# Altium schematic sheet 单片机系统电路.SchDoc
size A4; Time: 22/03/31
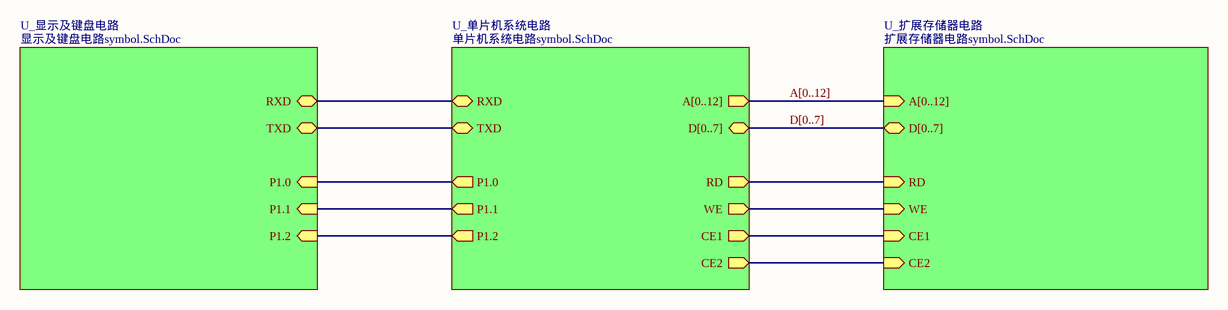
[diagram p0: 单片机系统电路.SchDoc]

## Sub-sheets
U_单片机系统电路 = 单片机系统电路symbol.SchDoc: RXD (bidir), TXD (bidir), P1.0 (out), P1.1 (out), P1.2 (out), A[0..12] (out), D[0..7] (bidir), RD (out), WE (out), CE1 (out), CE2 (out)
U_扩展存储器电路 = 扩展存储器电路symbol.SchDoc: A[0..12] (in), D[0..7] (bidir), RD (in), WE (in), CE1 (in), CE2 (in)
U_显示及键盘电路 = 显示及键盘电路symbol.SchDoc: RXD (bidir), TXD (bidir), P1.0 (in), P1.1 (in), P1.2 (in)

## Nets
(unnamed): sheet U_单片机系统电路/RXD, sheet U_显示及键盘电路/RXD
(unnamed): sheet U_单片机系统电路/TXD, sheet U_显示及键盘电路/TXD
(unnamed): sheet U_单片机系统电路/P1.0, sheet U_显示及键盘电路/P1.0
(unnamed): sheet U_单片机系统电路/P1.1, sheet U_显示及键盘电路/P1.1
(unnamed): sheet U_单片机系统电路/P1.2, sheet U_显示及键盘电路/P1.2
(unnamed): sheet U_单片机系统电路/RD, sheet U_扩展存储器电路/RD
(unnamed): sheet U_单片机系统电路/WE, sheet U_扩展存储器电路/WE
(unnamed): sheet U_单片机系统电路/CE1, sheet U_扩展存储器电路/CE1
(unnamed): sheet U_单片机系统电路/CE2, sheet U_扩展存储器电路/CE2

## Buses and harness runs
bus A[0..12] = sheet U_单片机系统电路/A[0..12] = sheet U_扩展存储器电路/A[0..12]
bus D[0..7] = sheet U_单片机系统电路/D[0..7] = sheet U_扩展存储器电路/D[0..7]

## Notes on the sheet
- 专升本
- 通信工程
- 李烨攀
- 2101班
- 210806300163
- 学号